# Altium schematic sheet Power.SchDoc: Power
size A3; DocumentNumber: 1; Revision: A; SheetNumber: 1; SheetTotal: 10
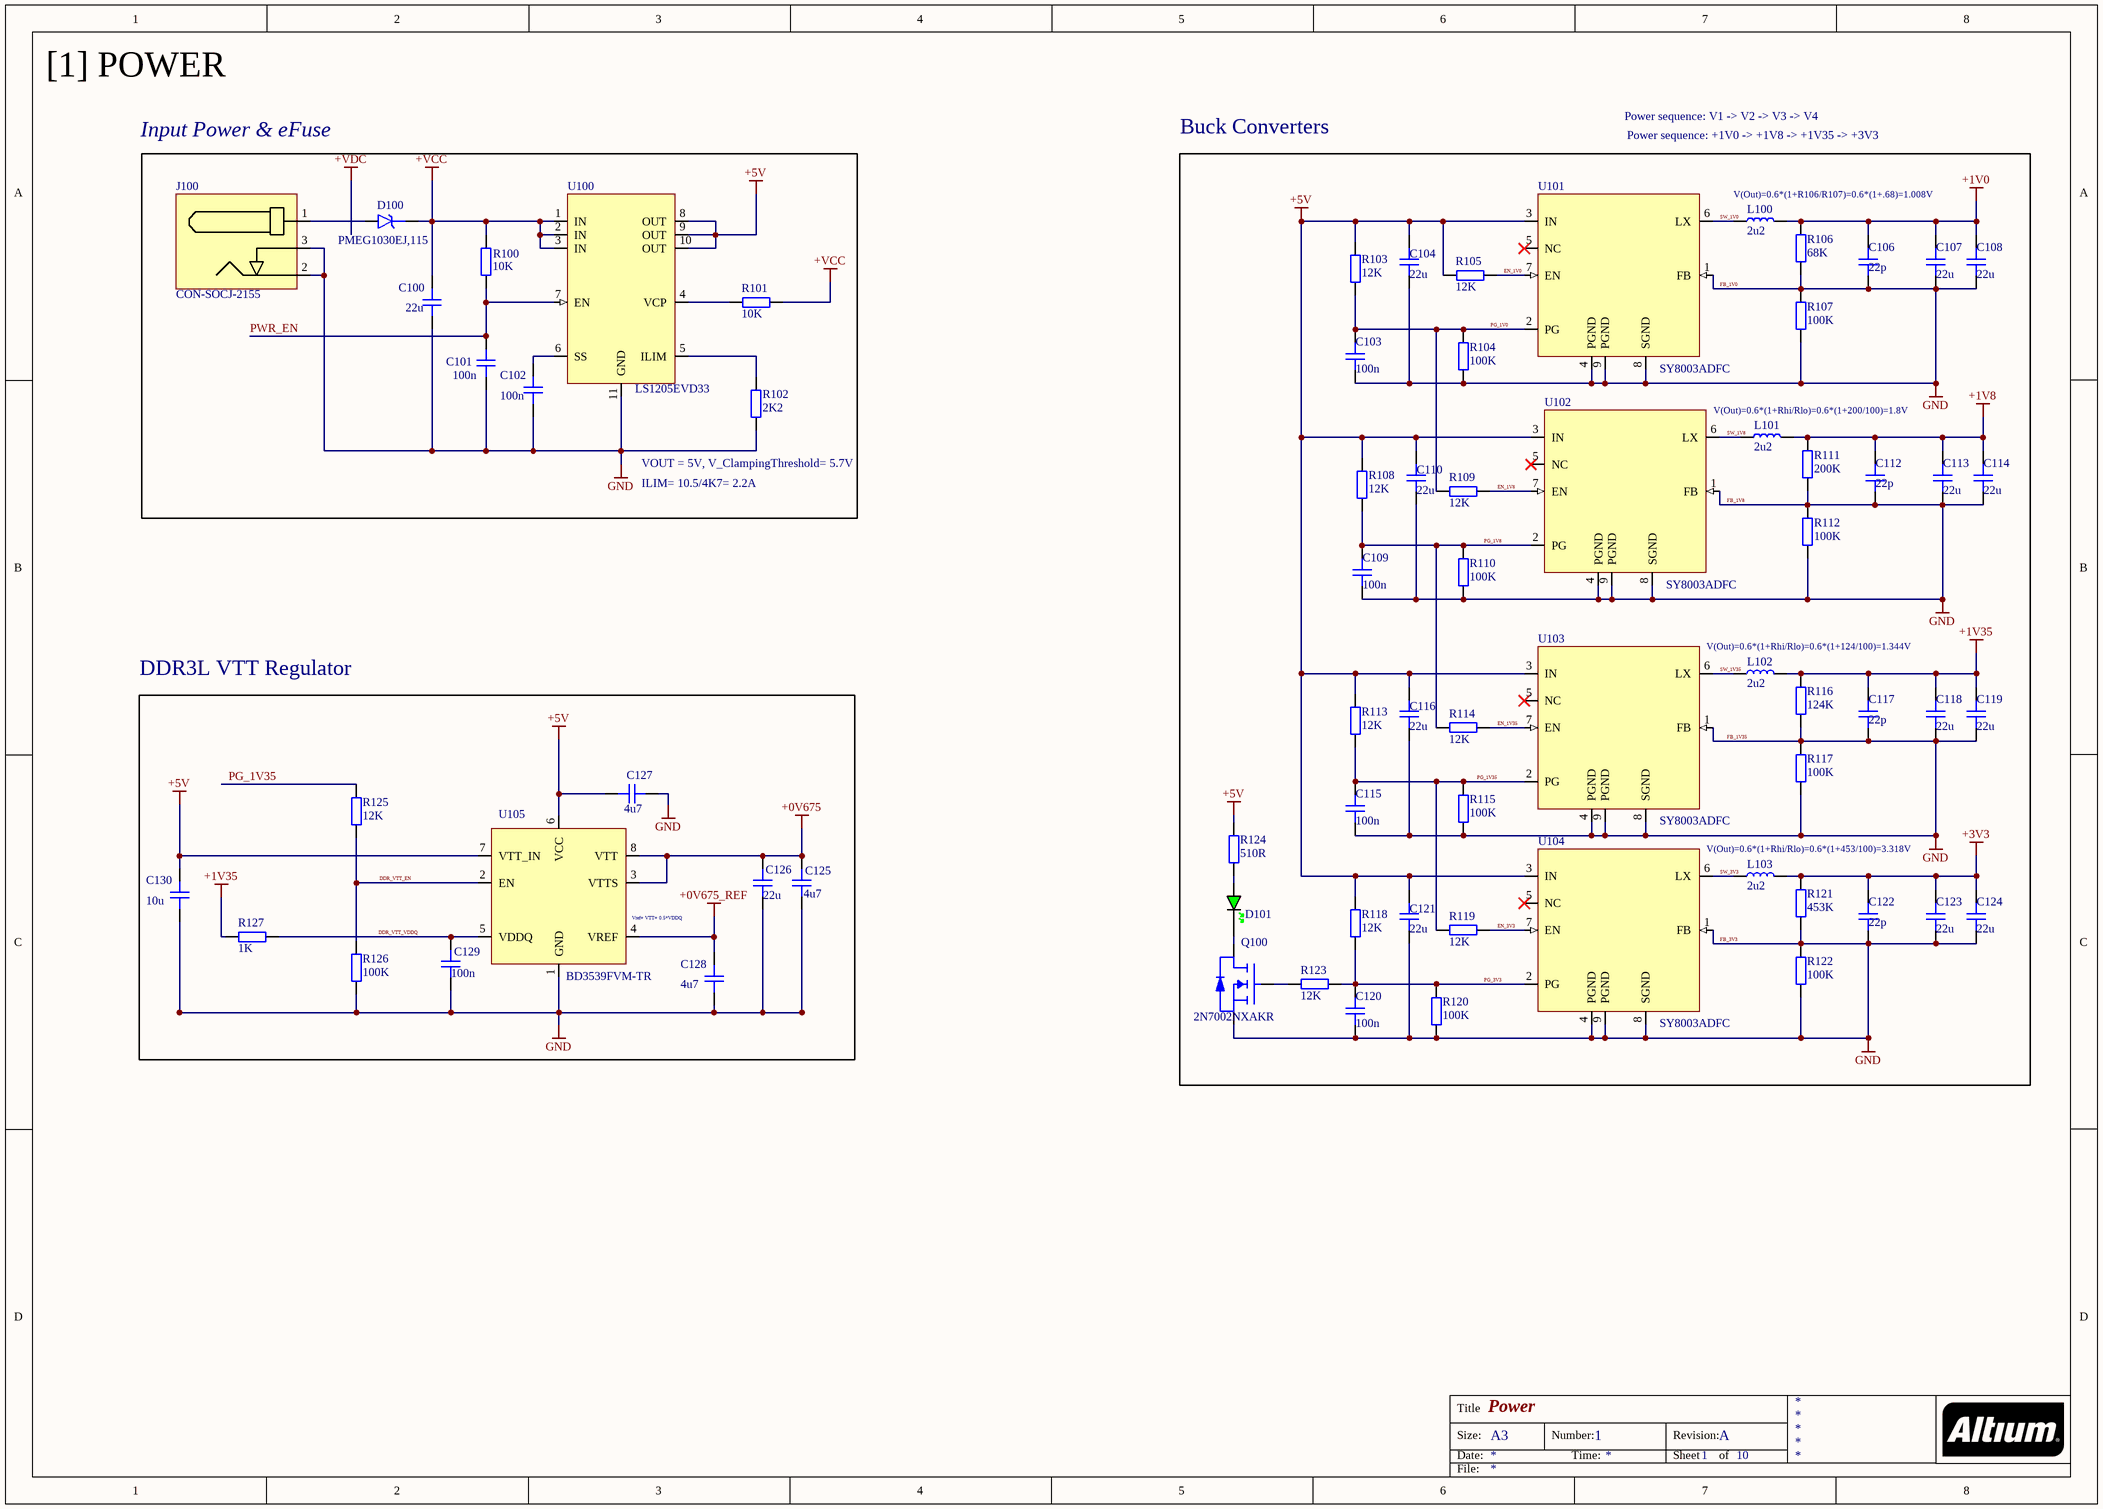
[diagram p0: Power.SchDoc]

## Parts
C100  22u  [CAP_1210]
C101  100n  [CAP_1210]
C102  100n  [CAP_1210]
C103  100n  [CAP_1210]
C104  22u  [CAP_1210]
C106  22p  [CAP_1210]
C107  22u  [CAP_1210]
C108  22u  [CAP_1210]
C109  100n  [CAP_1210]
C110  22u  [CAP_1210]
C112  22p  [CAP_1210]
C113  22u  [CAP_1210]
C114  22u  [CAP_1210]
C115  100n  [CAP_1210]
C116  22u  [CAP_1210]
C117  22p  [CAP_1210]
C118  22u  [CAP_1210]
C119  22u  [CAP_1210]
C120  100n  [CAP_1210]
C121  22u  [CAP_1210]
C122  22p  [CAP_1210]
C123  22u  [CAP_1210]
C124  22u  [CAP_1210]
C125  4u7  [CAP_1210]
C126  22u  [CAP_1210]
C127  4u7  [CAP_1210]
C128  4u7  [CAP_1210]
C129  100n  [CAP_1210]
C130  10u  [CAP_1210]
D100  PMEG1030EJ,115  [SOD-323]
D101  GREEN  [LED_0402_GREEN]  (value not drawn)
J100  CON-SOCJ-2155  [CON-SOCJ-2155]
L100  2u2  [NRS5020]
L101  2u2  [NRS5020]
L102  2u2  [NRS5020]
L103  2u2  [NRS5020]
Q100  2N7002NXAKR  [SSM3J338R,LF-SOT23-F]
R100  10K  [RES_0402]
R101  10K  [RES_0402]
R102  2K2  [RES_0402]
R103  12K  [RES_0402]
R104  100K  [RES_0402]
R105  12K  [RES_0402]
R106  68K  [RES_0402]
R107  100K  [RES_0402]
R108  12K  [RES_0402]
R109  12K  [RES_0402]
R110  100K  [RES_0402]
R111  200K  [RES_0402]
R112  100K  [RES_0402]
R113  12K  [RES_0402]
R114  12K  [RES_0402]
R115  100K  [RES_0402]
R116  124K  [RES_0402]
R117  100K  [RES_0402]
R118  12K  [RES_0402]
R119  12K  [RES_0402]
R120  100K  [RES_0402]
R121  453K  [RES_0402]
R122  100K  [RES_0402]
R123  12K  [RES_0402]
R124  510R  [RES_0402]
R125  12K  [RES_0402]
R126  100K  [RES_0402]
R127  1K  [RES_0402]
U100  LS1205EVD33  [DFN3x3_10L]
U101  SY8003ADFC  [DFN2x2-8]
U102  SY8003ADFC  [DFN2x2-8]
U103  SY8003ADFC  [DFN2x2-8]
U104  SY8003ADFC  [DFN2x2-8]
U105  BD3539FVM-TR  [MSOP8]

## Blocks framed on the sheet
Input Power & eFuse: C100-C102 D100 J100 R100-R102 U100
Buck Converters: C103 C104 C106-C110 C112-C124 D101 L100-L103 Q100 R103-R124 U101-U104
DDR3L VTT Regulator: C125-C130 R125-R127 U105

## Nets
+0V675: C125.2 C126.2 U105.3(VTTS) U105.8(VTT)
+0V675_REF: C128.2 U105.4(VREF)
+1V0: C106.2 C107.2 C108.2 L100.2 R106.1
+1V8: C112.2 C113.2 C114.2 L101.2 R111.1
+1V35: C117.2 C118.2 C119.2 L102.2 R116.1 R127.1
+3V3: C122.2 C123.2 C124.2 L103.2 R121.1
+5V: C104.2 C110.2 C116.2 C121.2 C127.2 C130.2 R103.1 R105.1 R108.1 R113.1 R118.1 R124.2 U100.8(OUT) U100.9(OUT) U100.10(OUT) U101.3(IN) U102.3(IN) U103.3(IN) U104.3(IN) U105.6(VCC) U105.7(VTT_IN)
+VCC: C100.2 D100.K R100.2 R101.1 U100.1(IN) U100.2(IN) U100.3(IN)
FB_1V0: C100.1 C101.1 C102.1 C103.1 C104.1 C106.1 C107.1 C108.1 C109.1 C110.1 C112.1 C113.1 C114.1 C115.1 C116.1 C117.1 C118.1 C119.1 C120.1 C121.1 C122.1 C123.1 C124.1 C125.1 C126.1 C127.1 C128.1 C129.1 C130.1 J100.2 J100.3 Q100.S R102.2 R104.2 R106.2 R107.1 R107.2 R110.2 R111.2 R112.1 R112.2 R115.2 R116.2 R117.1 R117.2 R120.2 R121.2 R122.1 R122.2 R126.2 U100.11(GND) U101.1(FB) U101.4(PGND) U101.8(SGND) U101.9(PGND) U102.1(FB) U102.4(PGND) U102.8(SGND) U102.9(PGND) U103.1(FB) U103.4(PGND) U103.8(SGND) U103.9(PGND) U104.1(FB) U104.4(PGND) U104.8(SGND) U104.9(PGND) U105.1(GND)  [also labelled FB_1V35, FB_1V8, FB_3V3, GND]
DDR_VTT_EN: R125.2 R126.1 U105.2(EN)
DDR_VTT_VDDQ: C129.2 R127.2 U105.5(VDDQ)
EN_1V0: R105.2 U101.7(EN)
EN_1V8: R109.2 U102.7(EN)
EN_1V35: R114.2 U103.7(EN)
EN_3V3: R119.2 U104.7(EN)
PG_1V0: C103.2 R103.2 R104.1 R109.1 U101.2(PG)
PG_1V8: C109.2 R108.2 R110.1 R114.1 U102.2(PG)
PG_1V35: C115.2 R113.2 R115.1 R119.1 R125.1 U103.2(PG)
PG_3V3: C120.2 R118.2 R120.1 R123.2 U104.2(PG)
PWR_EN: C101.2 R100.1 U100.7(EN)
SW_1V0: L100.1 U101.6(LX)
SW_1V8: L101.1 U102.6(LX)
SW_1V35: L102.1 U103.6(LX)
SW_3V3: L103.1 U104.6(LX)
NetC102_2: C102.2 U100.6(SS)
NetD100_A: D100.A J100.1
NetD101_A: D101.A R124.1
NetD101_K: D101.K Q100.D
NetQ100_G: Q100.G R123.1
NetR101_2: R101.2 U100.4(VCP)
NetR102_1: R102.1 U100.5(ILIM)

Not connected (* = marked no-connect by the designer): U101 5(NC)*; U102 5(NC)*; U103 5(NC)*; U104 5(NC)*

## Notes on the sheet
- [1] POWER
- Power sequence: V1 -> V2 -> V3 -> V4
- Power sequence: +1V0 -> +1V8 -> +1V35 -> +3V3
- V(Out)=0.6*(1+R106/R107)=0.6*(1+.68)=1.008V
- V(Out)=0.6*(1+Rhi/Rlo)=0.6*(1+200/100)=1.8V
- ILIM= 10.5/4K7= 2.2A
- (near R102) VOUT = 5V, V_ClampingThreshold= 5.7V
- V(Out)=0.6*(1+Rhi/Rlo)=0.6*(1+124/100)=1.344V
- V(Out)=0.6*(1+Rhi/Rlo)=0.6*(1+453/100)=3.318V
- (near U105) Vref= VTT= 0.5*VDDQ
- Title
- Size:
- Date:
- A3
- Number:
- Time:
- Revision:
- Sheet
- of
- File:

## Library data of the parts
C100-C104 C106-C110 C112-C130 = CAP_1210: Capacitor SMD 1210; Manufacturer: *; Manufacturer Part Number: *; Distributor Link: *; LCSC: *; Rating: *; Dielectric: *
D100 = D_ZENER_SOD_323: Diode Zener SMD SOD-323
D101 = LED_0402_GREEN: LED 0402 GREEN SMD
J100 = CON-SOCJ-2155: DC Barrell Jack 2.1mm 30V 2.5A THT; Manufacturer: Gravitech; Manufacturer Part Number: CON-SOCJ-2155
L100-L103 = NRS5020: NRS5020 SMD Power Inductor Taiyo Yuden; Manufacturer: Taiyo Yuden; Manufacturer Part Number: NRS5020
Q100 = 2N7002NXAKR: MOSFET N-Channel Vds=60V Id=300mA with ESD Protection; Manufacturer: Nexperia; Manufacturer Part Number: 2N7002NXAKR
R100-R127 = RES_0402: Resistor SMD 0402; Manufacturer: *; Manufacturer Part Number: *; Distributor Link: *; LCSC: *
U100 = LS1205EVD33: 18V, 5A eFuse with Programmable Current Limit and Output Voltage Clamp; Manufacturer: Littelfuse; Manufacturer Part Number: LS1205EVD33
U101-U104 = SY8003ADFC: High Efficiency 5.5V, 3A Continuous, 1MHz Synchronous Step Down Regulator; Manufacturer: Silergy; Manufacturer Part Number: High Efficiency 5.5V, 3A continuous, 1MHz; LCSC: C178236
U105 = BD3539FVM-TR: 1.0V to 5.5V, 1A 1Ch Termination Regulator for DDR-SDRAMs; Manufacturer: ROHM Semiconductor; Manufacturer Part Number: BD3539FVM-TR